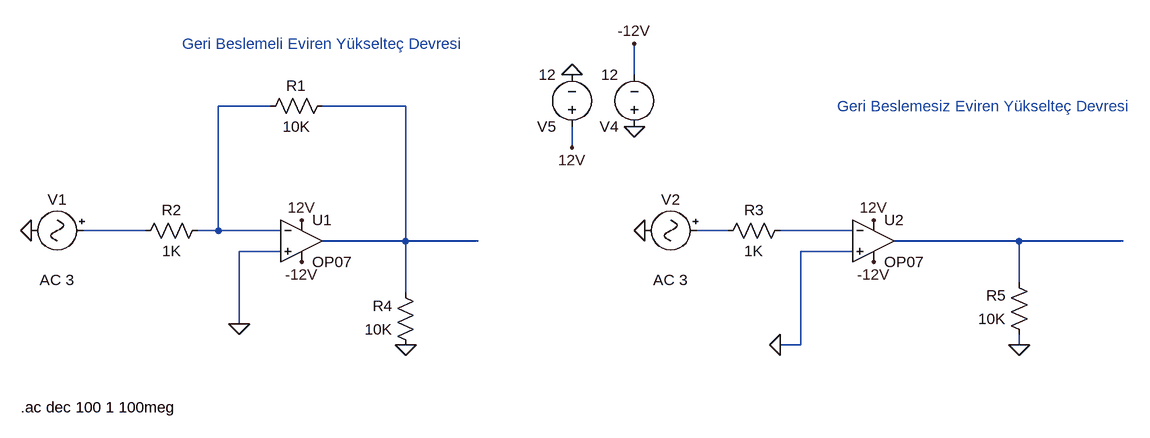
[diagram p0: schematic Draft5.asc]
Draft5.asc, the LTspice schematic file:
Version 4
SHEET 1 1364 680
WIRE 512 -112 512 -160
WIRE -48 -64 -128 -64
WIRE 160 -64 32 -64
WIRE 416 0 416 -32
WIRE -240 128 -336 128
WIRE -128 128 -128 -64
WIRE -128 128 -160 128
WIRE -32 128 -128 128
WIRE 656 128 608 128
WIRE 848 128 736 128
WIRE 160 144 160 -64
WIRE 160 144 32 144
WIRE 272 144 160 144
WIRE 1104 144 912 144
WIRE 1264 144 1104 144
WIRE -32 160 -96 160
WIRE 848 160 768 160
WIRE 1104 208 1104 144
WIRE 160 224 160 144
WIRE -96 272 -96 160
WIRE 768 304 768 160
WIRE 768 304 736 304
WIRE 1104 304 1104 288
FLAG 160 304 0
FLAG 528 128 0
FLAG 1104 304 0
FLAG 416 0 12V
FLAG 416 -112 0
FLAG 512 -32 0
FLAG 512 -160 -12V
FLAG 0 112 12V
FLAG 880 112 12V
FLAG 0 176 -12V
FLAG 880 176 -12V
FLAG -96 272 0
FLAG 736 304 0
FLAG -416 128 0
SYMBOL OpAmps\\OP07 0 80 R0
SYMATTR InstName U1
SYMBOL OpAmps\\OP07 880 80 R0
SYMATTR InstName U2
SYMBOL res 48 -80 R90
WINDOW 0 0 56 VBottom 2
WINDOW 3 32 56 VTop 2
SYMATTR InstName R1
SYMATTR Value 10K
SYMBOL res -144 112 R90
WINDOW 0 0 56 VBottom 2
WINDOW 3 32 56 VTop 2
SYMATTR InstName R2
SYMATTR Value 1K
SYMBOL res 752 112 R90
WINDOW 0 0 56 VBottom 2
WINDOW 3 32 56 VTop 2
SYMATTR InstName R3
SYMATTR Value 1K
SYMBOL res 176 320 R180
WINDOW 0 36 76 Left 2
WINDOW 3 36 40 Left 2
SYMATTR InstName R4
SYMATTR Value 10K
SYMBOL res 1120 304 R180
WINDOW 0 36 76 Left 2
WINDOW 3 36 40 Left 2
SYMATTR InstName R5
SYMATTR Value 10K
SYMBOL Misc\\signal -320 128 R90
WINDOW 0 -32 56 VBottom 2
WINDOW 3 32 56 VTop 2
WINDOW 123 60 56 VTop 2
WINDOW 39 0 0 Left 0
SYMATTR InstName V1
SYMATTR Value ""
SYMATTR Value2 AC 3
SYMBOL Misc\\signal 624 128 R90
WINDOW 0 -32 56 VBottom 2
WINDOW 3 32 56 VTop 2
WINDOW 123 60 56 VTop 2
WINDOW 39 0 0 Left 0
SYMATTR InstName V2
SYMATTR Value ""
SYMATTR Value2 AC 3
SYMBOL voltage 512 -16 R180
WINDOW 123 0 0 Left 0
WINDOW 39 0 0 Left 0
SYMATTR InstName V4
SYMATTR Value 12
SYMBOL voltage 416 -16 R180
WINDOW 123 0 0 Left 0
WINDOW 39 0 0 Left 0
SYMATTR InstName V5
SYMATTR Value 12
TEXT -432 400 Left 2 !.ac dec 100 1 100meg
TEXT -184 -160 Left 2 ;Geri Beslemeli Eviren Yükselteç Devresi
TEXT 824 -64 Left 2 ;Geri Beslemesiz Eviren Yükselteç Devresi

The netlist it stands for:
* Draft5.asc
XU1 0 N001 12V -12V N002 LT1001  ; OP07, pins In+ In- V+ V- OUT
XU2 0 N005 12V -12V N006 LT1001  ; OP07, pins In+ In- V+ V- OUT
R1 N002 N001 10K
R2 N001 N003 1K
R3 N005 N004 1K
R4 0 N002 10K
R5 0 N006 10K
V1 N003 0 AC 3
V2 N004 0 AC 3
V4 0 -12V 12
V5 12V 0 12
.ac dec 100 1 100meg
* Geri Beslemeli Eviren Yükselteç Devresi
* Geri Beslemesiz Eviren Yükselteç Devresi
.lib LTC.lib
.backanno
.end